# Altium schematic sheet EEG&ECG.SchDoc
size A0
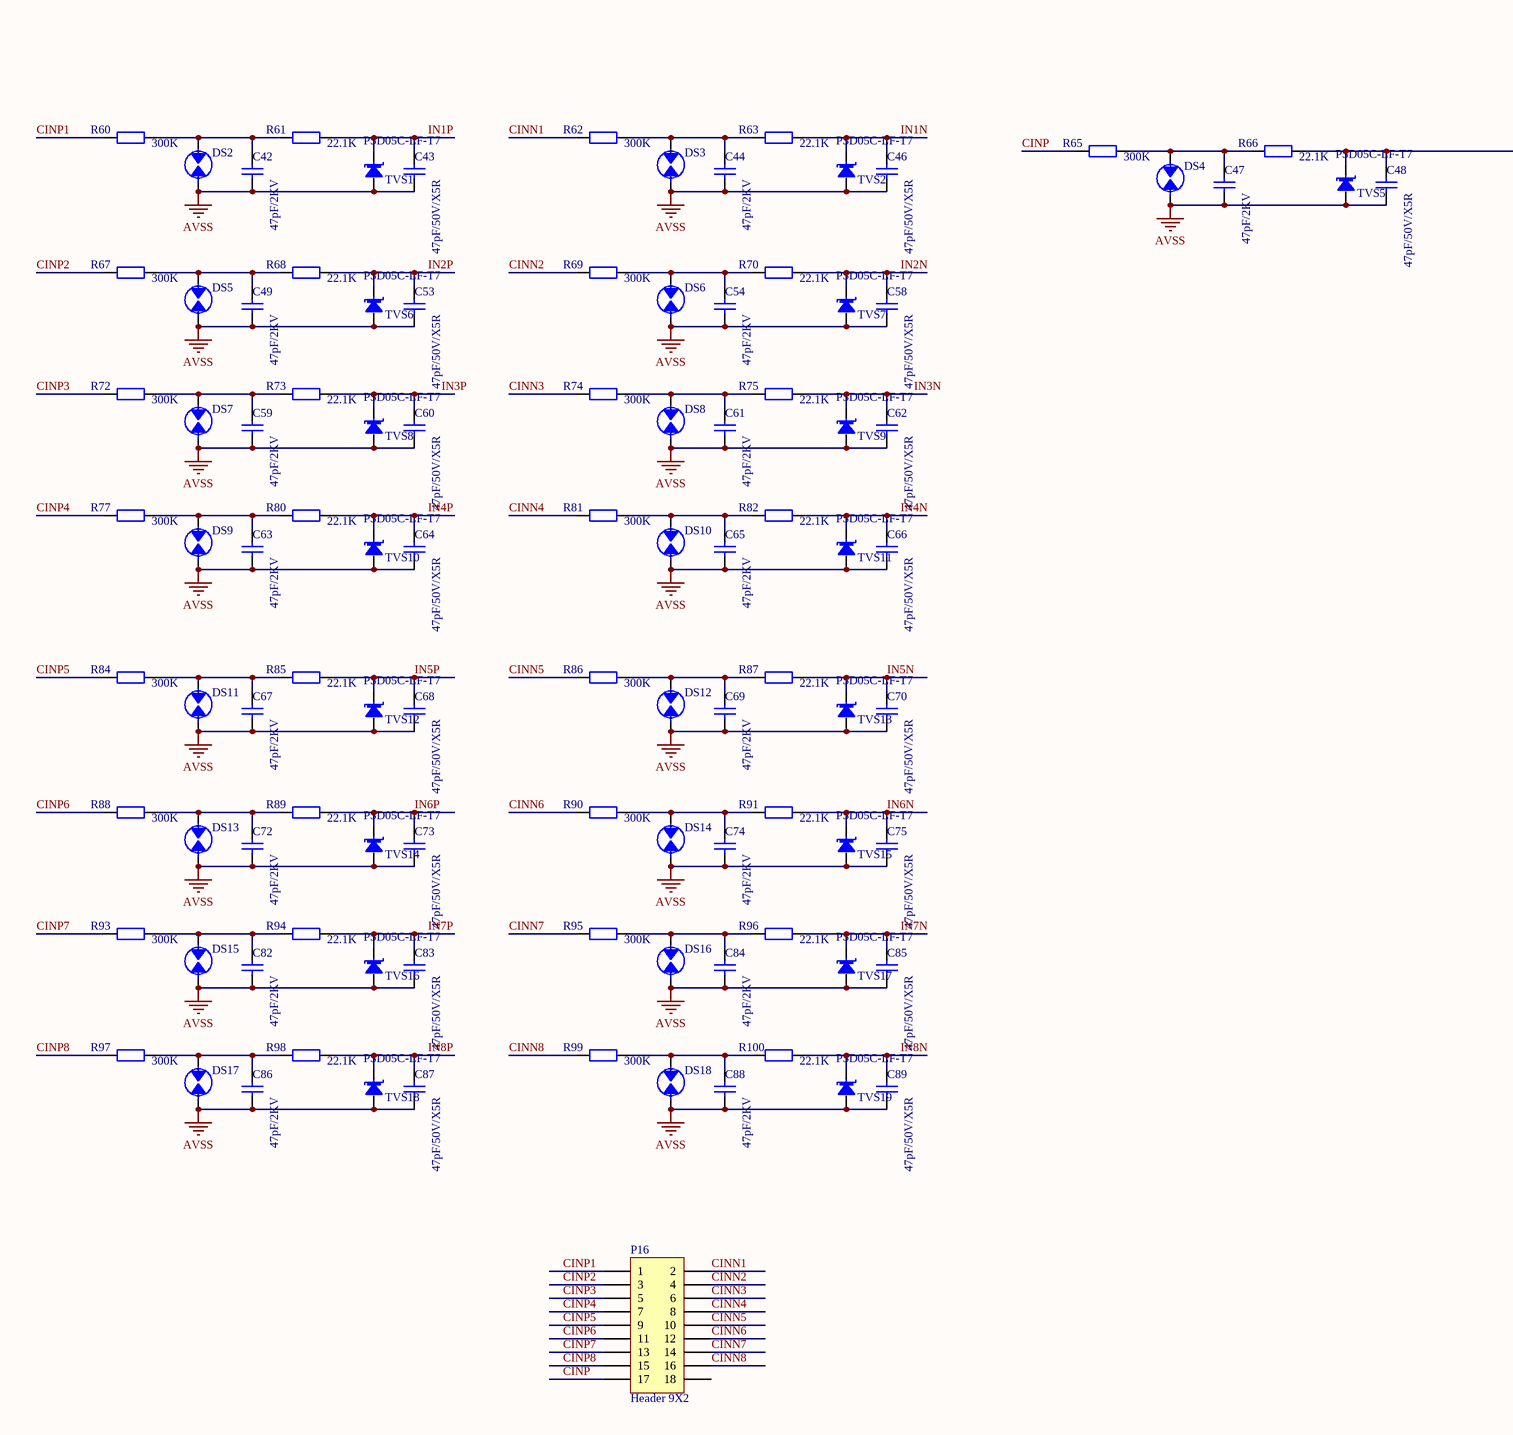
[diagram p0: EEG&ECG.SchDoc, top left]
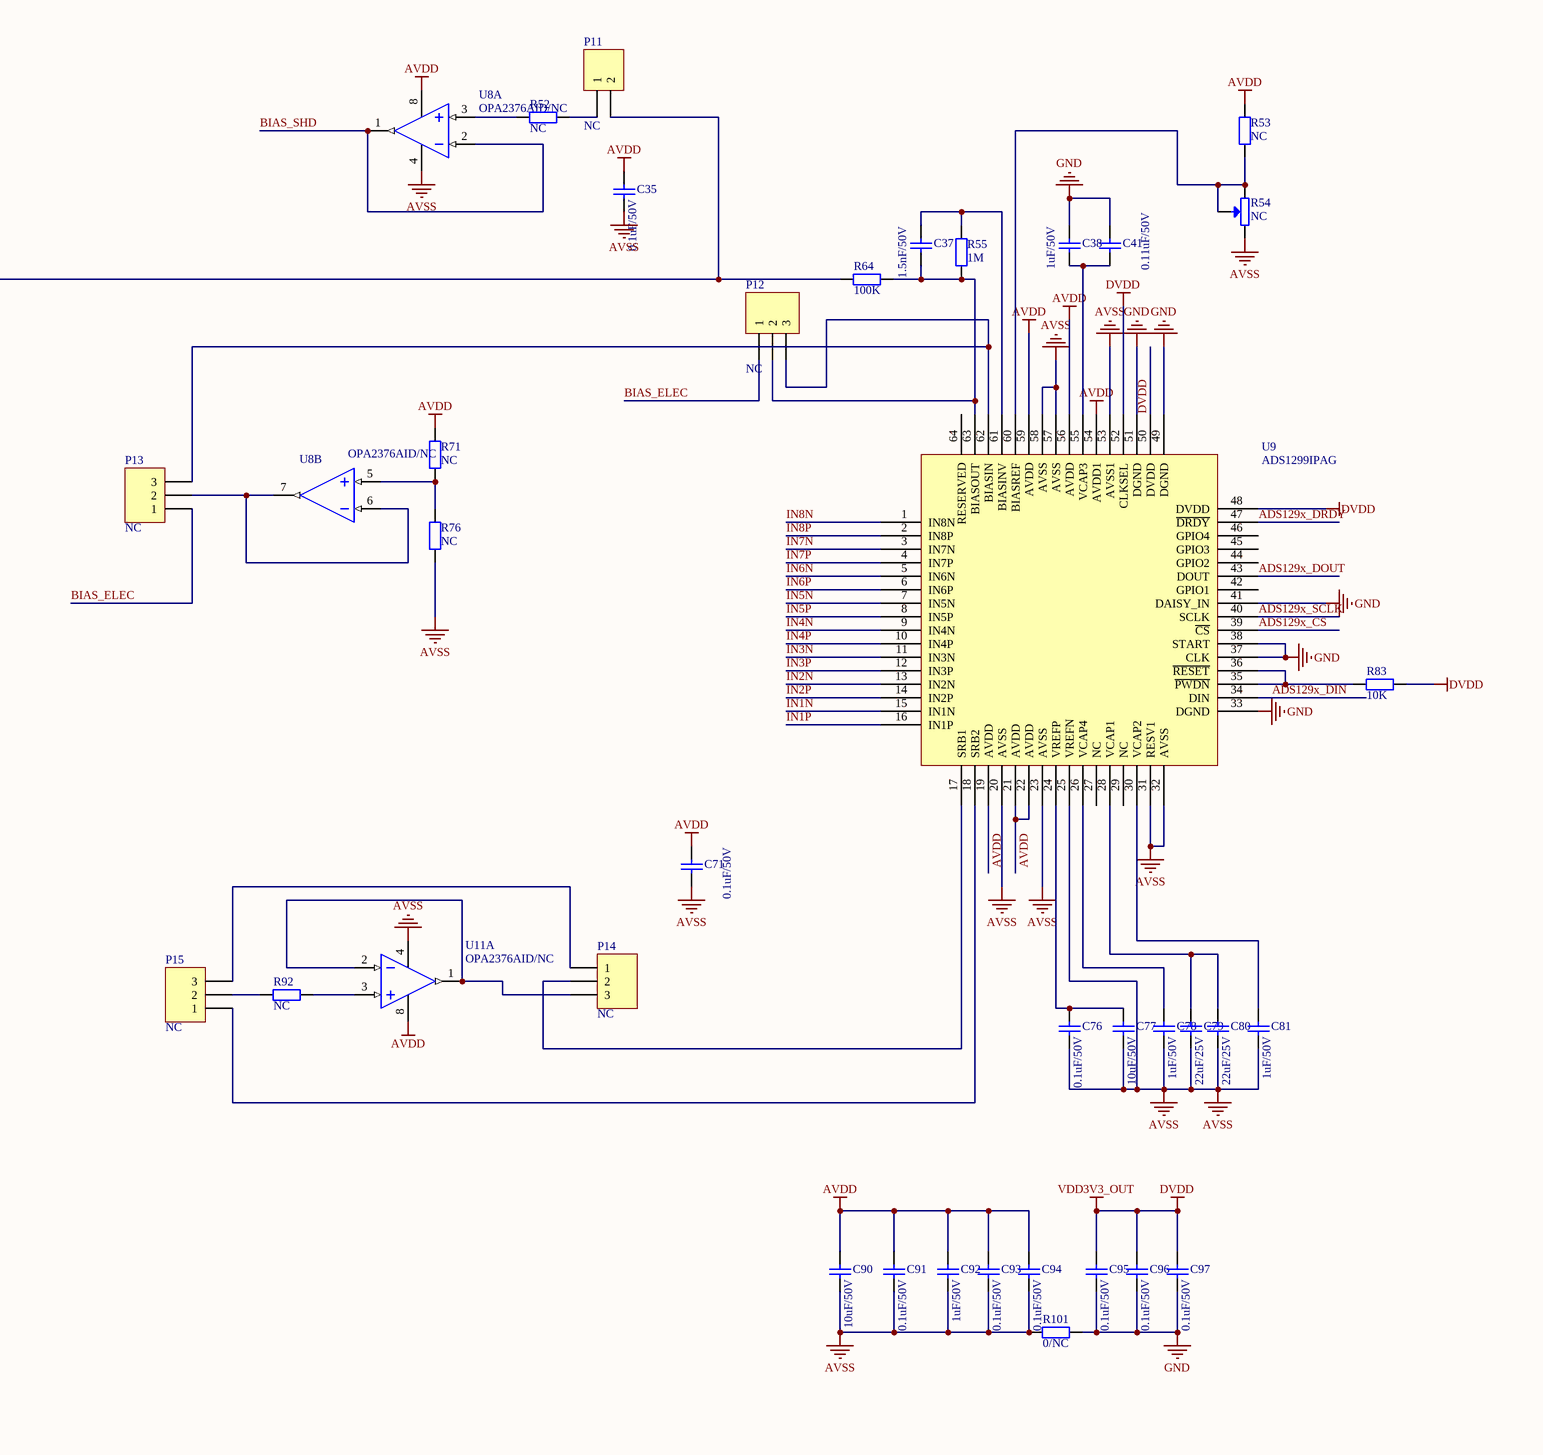
[diagram p1: EEG&ECG.SchDoc, top right]
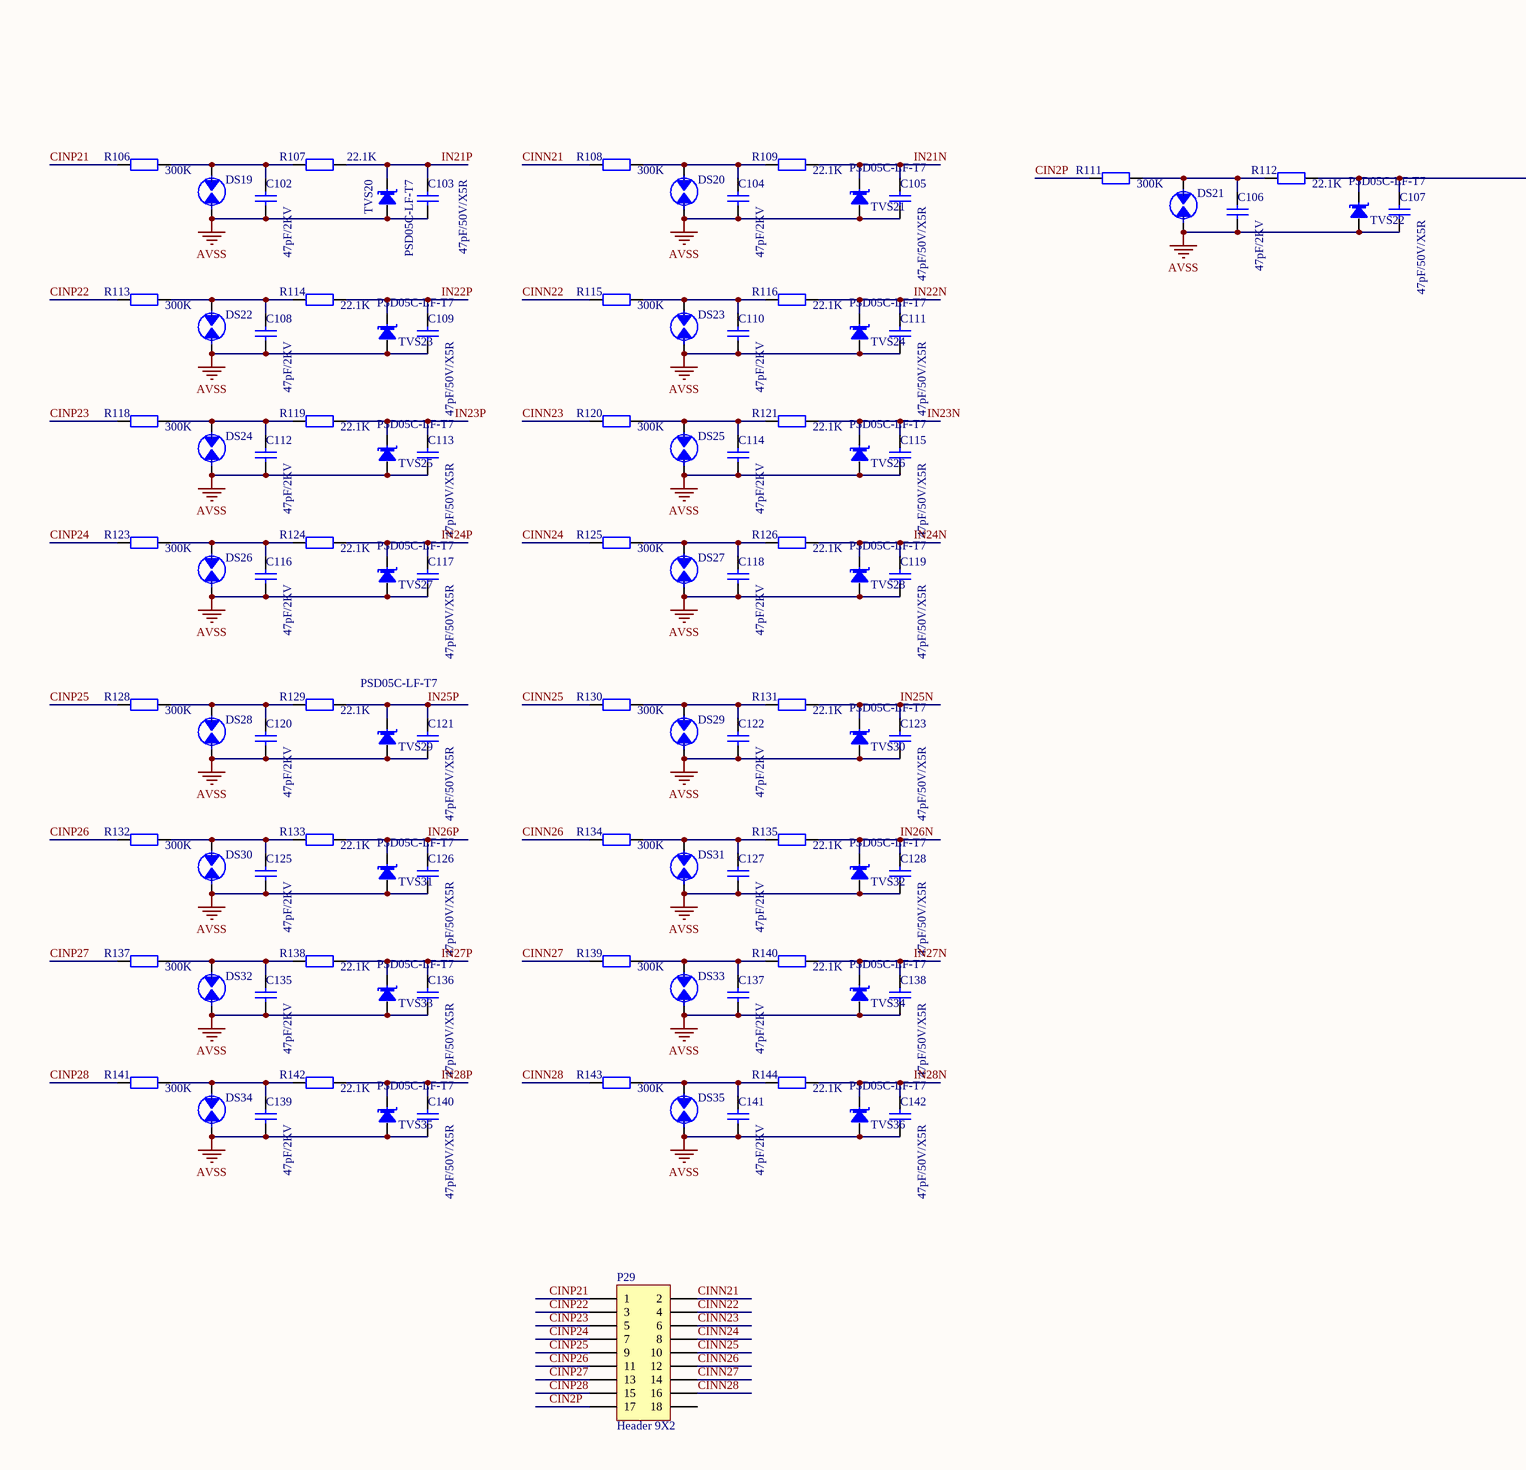
[diagram p2: EEG&ECG.SchDoc, bottom left]
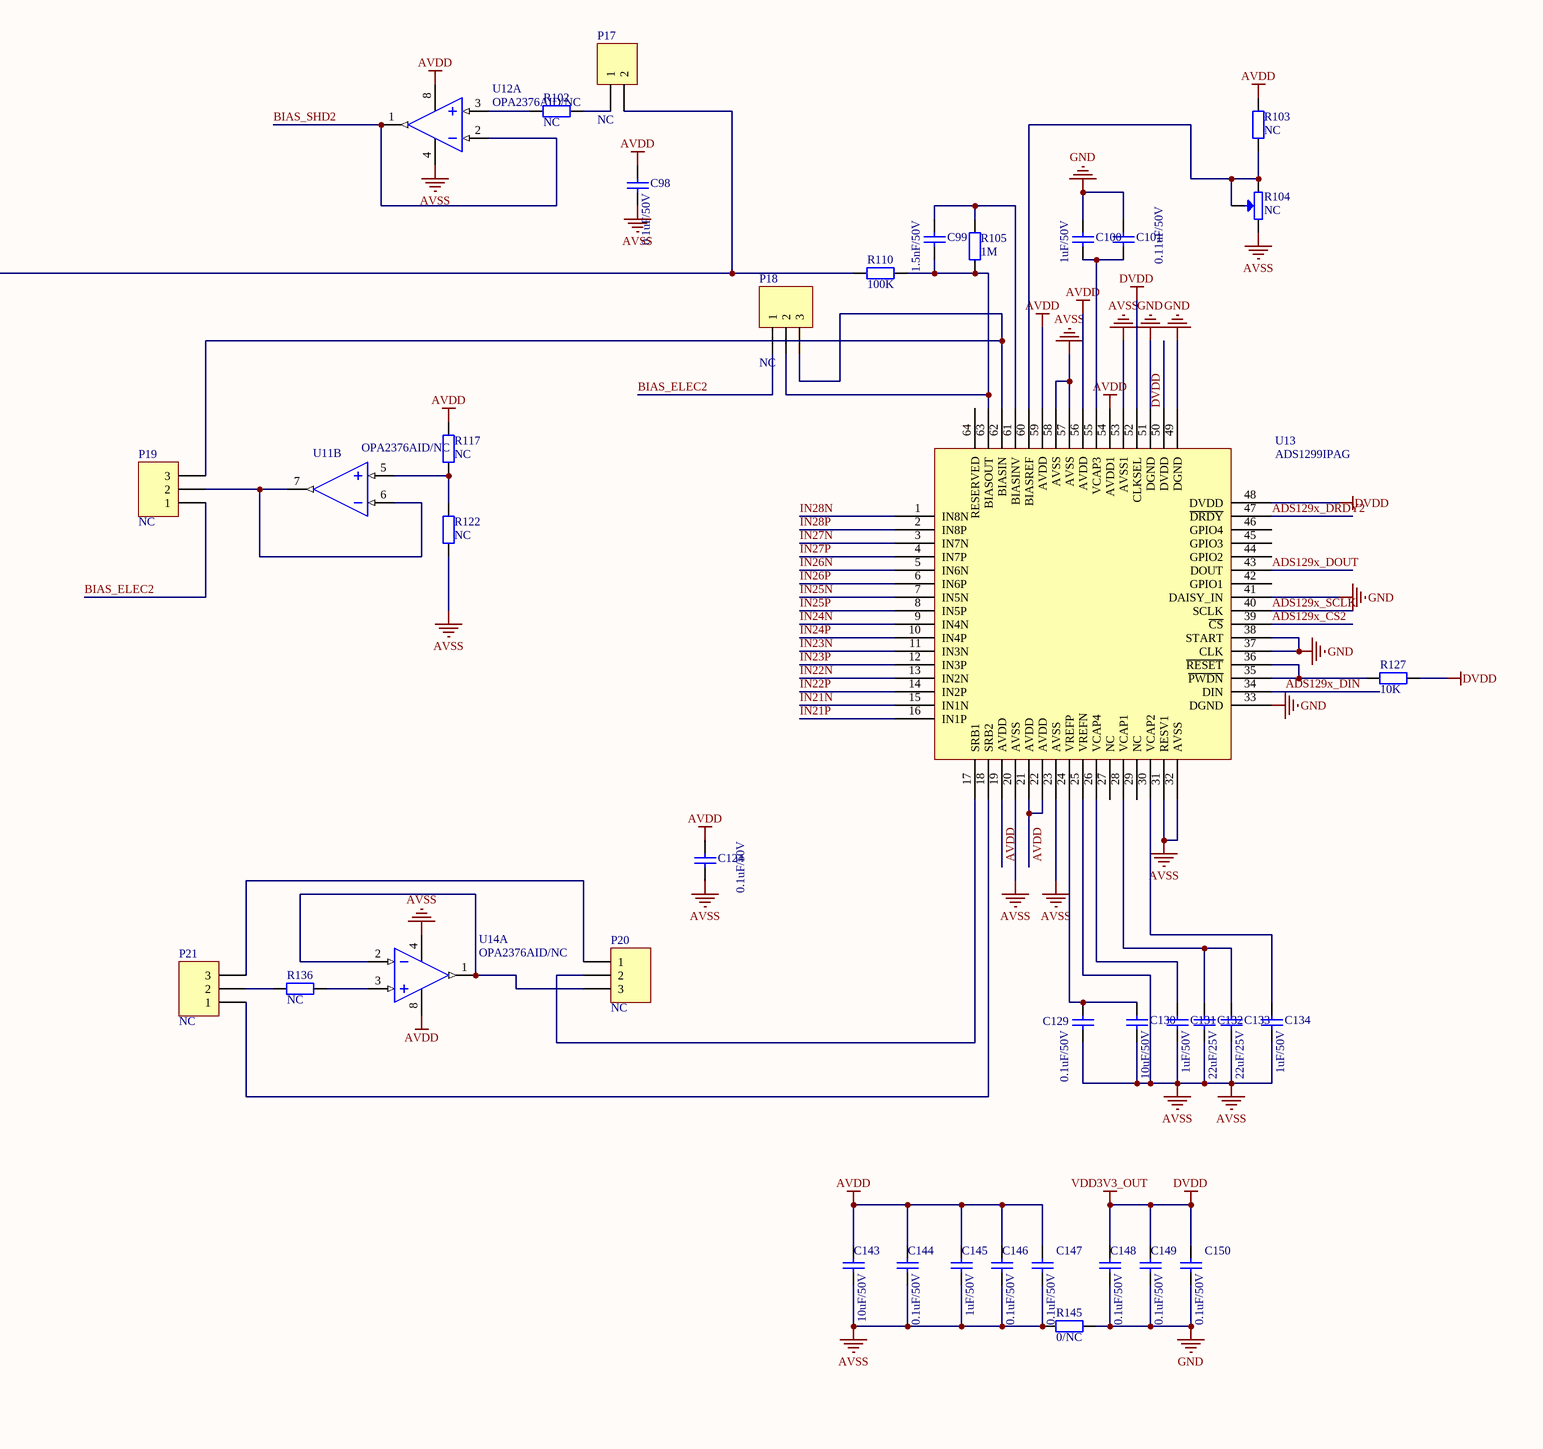
[diagram p3: EEG&ECG.SchDoc, bottom right]

## Parts
C35  0.1uF/50V  [SMD-0603C]
C37  1.5nF/50V  [SMD-0603C]
C38  1uF/50V  [SMD-0603C]
C41  0.11uF/50V  [SMD-0603C]
C42  47pF/2KV  [1206c]
C43  47pF/50V/X5R  [SMD-0603C]
C44  47pF/2KV  [1206c]
C46  47pF/50V/X5R  [SMD-0603C]
C47  47pF/2KV  [1206c]
C48  47pF/50V/X5R  [SMD-0603C]
C49  47pF/2KV  [1206c]
C53  47pF/50V/X5R  [SMD-0603C]
C54  47pF/2KV  [1206c]
C58  47pF/50V/X5R  [SMD-0603C]
C59  47pF/2KV  [1206c]
C60  47pF/50V/X5R  [SMD-0603C]
C61  47pF/2KV  [1206c]
C62  47pF/50V/X5R  [SMD-0603C]
C63  47pF/2KV  [1206c]
C64  47pF/50V/X5R  [SMD-0603C]
C65  47pF/2KV  [1206c]
C66  47pF/50V/X5R  [SMD-0603C]
C67  47pF/2KV  [1206c]
C68  47pF/50V/X5R  [SMD-0603C]
C69  47pF/2KV  [1206c]
C70  47pF/50V/X5R  [SMD-0603C]
C71  0.1uF/50V  [SMD-0603C]
C72  47pF/2KV  [1206c]
C73  47pF/50V/X5R  [SMD-0603C]
C74  47pF/2KV  [1206c]
C75  47pF/50V/X5R  [SMD-0603C]
C76  0.1uF/50V  [SMD-0603C]
C77  10uF/50V  [SMD-0805C]
C78  1uF/50V  [SMD-0603C]
C79  22uF/25V  [SMD-0805C]
C80  22uF/25V  [SMD-0805C]
C81  1uF/50V  [SMD-0603C]
C82  47pF/2KV  [1206c]
C83  47pF/50V/X5R  [SMD-0603C]
C84  47pF/2KV  [1206c]
C85  47pF/50V/X5R  [SMD-0603C]
C86  47pF/2KV  [1206c]
C87  47pF/50V/X5R  [SMD-0603C]
C88  47pF/2KV  [1206c]
C89  47pF/50V/X5R  [SMD-0603C]
C90  10uF/50V  [SMD-0805C]
C91  0.1uF/50V  [SMD-0603C]
C92  1uF/50V  [SMD-0603C]
C93  0.1uF/50V  [SMD-0603C]
C94  0.1uF/50V  [SMD-0603C]
C95  0.1uF/50V  [SMD-0603C]
C96  0.1uF/50V  [SMD-0603C]
C97  0.1uF/50V  [SMD-0603C]
C98  0.1uF/50V  [SMD-0603C]
C99  1.5nF/50V  [SMD-0603C]
C100  1uF/50V  [SMD-0603C]
C101  0.11uF/50V  [SMD-0603C]
C102  47pF/2KV  [1206c]
C103  47pF/50V/X5R  [SMD-0603C]
C104  47pF/2KV  [1206c]
C105  47pF/50V/X5R  [SMD-0603C]
C106  47pF/2KV  [1206c]
C107  47pF/50V/X5R  [SMD-0603C]
C108  47pF/2KV  [1206c]
C109  47pF/50V/X5R  [SMD-0603C]
C110  47pF/2KV  [1206c]
C111  47pF/50V/X5R  [SMD-0603C]
C112  47pF/2KV  [1206c]
C113  47pF/50V/X5R  [SMD-0603C]
C114  47pF/2KV  [1206c]
C115  47pF/50V/X5R  [SMD-0603C]
C116  47pF/2KV  [1206c]
C117  47pF/50V/X5R  [SMD-0603C]
C118  47pF/2KV  [1206c]
C119  47pF/50V/X5R  [SMD-0603C]
C120  47pF/2KV  [1206c]
C121  47pF/50V/X5R  [SMD-0603C]
C122  47pF/2KV  [1206c]
C123  47pF/50V/X5R  [SMD-0603C]
C124  0.1uF/50V  [SMD-0603C]
C125  47pF/2KV  [1206c]
C126  47pF/50V/X5R  [SMD-0603C]
C127  47pF/2KV  [1206c]
C128  47pF/50V/X5R  [SMD-0603C]
C129  0.1uF/50V  [SMD-0603C]
C130  10uF/50V  [SMD-0805C]
C131  1uF/50V  [SMD-0603C]
C132  22uF/25V  [SMD-0805C]
C133  22uF/25V  [SMD-0805C]
C134  1uF/50V  [SMD-0603C]
C135  47pF/2KV  [1206c]
C136  47pF/50V/X5R  [SMD-0603C]
C137  47pF/2KV  [1206c]
C138  47pF/50V/X5R  [SMD-0603C]
C139  47pF/2KV  [1206c]
C140  47pF/50V/X5R  [SMD-0603C]
C141  47pF/2KV  [1206c]
C142  47pF/50V/X5R  [SMD-0603C]
C143  10uF/50V  [SMD-0805C]
C144  0.1uF/50V  [SMD-0603C]
C145  1uF/50V  [SMD-0603C]
C146  0.1uF/50V  [SMD-0603C]
C147  0.1uF/50V  [SMD-0603C]
C148  0.1uF/50V  [SMD-0603C]
C149  0.1uF/50V  [SMD-0603C]
C150  0.1uF/50V  [SMD-0603C]
DS2  UN1812-90CSMD  [SMD-1812]  (value not drawn)
DS3  UN1812-90CSMD  [SMD-1812]  (value not drawn)
DS4  UN1812-90CSMD  [SMD-1812]  (value not drawn)
DS5  UN1812-90CSMD  [SMD-1812]  (value not drawn)
DS6  UN1812-90CSMD  [SMD-1812]  (value not drawn)
DS7  UN1812-90CSMD  [SMD-1812]  (value not drawn)
DS8  UN1812-90CSMD  [SMD-1812]  (value not drawn)
DS9  UN1812-90CSMD  [SMD-1812]  (value not drawn)
DS10  UN1812-90CSMD  [SMD-1812]  (value not drawn)
DS11  UN1812-90CSMD  [SMD-1812]  (value not drawn)
DS12  UN1812-90CSMD  [SMD-1812]  (value not drawn)
DS13  UN1812-90CSMD  [SMD-1812]  (value not drawn)
DS14  UN1812-90CSMD  [SMD-1812]  (value not drawn)
DS15  UN1812-90CSMD  [SMD-1812]  (value not drawn)
DS16  UN1812-90CSMD  [SMD-1812]  (value not drawn)
DS17  UN1812-90CSMD  [SMD-1812]  (value not drawn)
DS18  UN1812-90CSMD  [SMD-1812]  (value not drawn)
DS19  UN1812-90CSMD  [SMD-1812]  (value not drawn)
DS20  UN1812-90CSMD  [SMD-1812]  (value not drawn)
DS21  UN1812-90CSMD  [SMD-1812]  (value not drawn)
DS22  UN1812-90CSMD  [SMD-1812]  (value not drawn)
DS23  UN1812-90CSMD  [SMD-1812]  (value not drawn)
DS24  UN1812-90CSMD  [SMD-1812]  (value not drawn)
DS25  UN1812-90CSMD  [SMD-1812]  (value not drawn)
DS26  UN1812-90CSMD  [SMD-1812]  (value not drawn)
DS27  UN1812-90CSMD  [SMD-1812]  (value not drawn)
DS28  UN1812-90CSMD  [SMD-1812]  (value not drawn)
DS29  UN1812-90CSMD  [SMD-1812]  (value not drawn)
DS30  UN1812-90CSMD  [SMD-1812]  (value not drawn)
DS31  UN1812-90CSMD  [SMD-1812]  (value not drawn)
DS32  UN1812-90CSMD  [SMD-1812]  (value not drawn)
DS33  UN1812-90CSMD  [SMD-1812]  (value not drawn)
DS34  UN1812-90CSMD  [SMD-1812]  (value not drawn)
DS35  UN1812-90CSMD  [SMD-1812]  (value not drawn)
P11  NC  [HDR1X2]
P12  NC  [HDR1X3]
P13  NC  [HDR1X3]
P14  NC  [HDR1X3]
P15  NC  [HDR1X3]
P16  Header 9X2  [HDR2X9]
P17  NC  [HDR1X2]
P18  NC  [HDR1X3]
P19  NC  [HDR1X3]
P20  NC  [HDR1X3]
P21  NC  [HDR1X3]
P29  Header 9X2  [HDR2X9]
R52  NC  [SMD-0603]
R53  NC  [SMD-0603]
R54  NC  [VR-05]
R55  1M  [SMD-0603]
R60  300K  [SMD-0603]
R61  22.1K  [SMD-0603]
R62  300K  [SMD-0603]
R63  22.1K  [SMD-0603]
R64  100K  [SMD-0603]
R65  300K  [SMD-0603]
R66  22.1K  [SMD-0603]
R67  300K  [SMD-0603]
R68  22.1K  [SMD-0603]
R69  300K  [SMD-0603]
R70  22.1K  [SMD-0603]
R71  NC  [SMD-0603]
R72  300K  [SMD-0603]
R73  22.1K  [SMD-0603]
R74  300K  [SMD-0603]
R75  22.1K  [SMD-0603]
R76  NC  [SMD-0603]
R77  300K  [SMD-0603]
R80  22.1K  [SMD-0603]
R81  300K  [SMD-0603]
R82  22.1K  [SMD-0603]
R83  10K  [SMD-0603]
R84  300K  [SMD-0603]
R85  22.1K  [SMD-0603]
R86  300K  [SMD-0603]
R87  22.1K  [SMD-0603]
R88  300K  [SMD-0603]
R89  22.1K  [SMD-0603]
R90  300K  [SMD-0603]
R91  22.1K  [SMD-0603]
R92  NC  [SMD-0603]
R93  300K  [SMD-0603]
R94  22.1K  [SMD-0603]
R95  300K  [SMD-0603]
R96  22.1K  [SMD-0603]
R97  300K  [SMD-0603]
R98  22.1K  [SMD-0603]
R99  300K  [SMD-0603]
R100  22.1K  [SMD-0603]
R101  0/NC  [SMD-1206]
R102  NC  [SMD-0603]
R103  NC  [SMD-0603]
R104  NC  [VR-05]
R105  1M  [SMD-0603]
R106  300K  [SMD-0603]
R107  22.1K  [SMD-0603]
R108  300K  [SMD-0603]
R109  22.1K  [SMD-0603]
R110  100K  [SMD-0603]
R111  300K  [SMD-0603]
R112  22.1K  [SMD-0603]
R113  300K  [SMD-0603]
R114  22.1K  [SMD-0603]
R115  300K  [SMD-0603]
R116  22.1K  [SMD-0603]
R117  NC  [SMD-0603]
R118  300K  [SMD-0603]
R119  22.1K  [SMD-0603]
R120  300K  [SMD-0603]
R121  22.1K  [SMD-0603]
R122  NC  [SMD-0603]
R123  300K  [SMD-0603]
R124  22.1K  [SMD-0603]
R125  300K  [SMD-0603]
R126  22.1K  [SMD-0603]
R127  10K  [SMD-0603]
R128  300K  [SMD-0603]
R129  22.1K  [SMD-0603]
R130  300K  [SMD-0603]
R131  22.1K  [SMD-0603]
R132  300K  [SMD-0603]
R133  22.1K  [SMD-0603]
R134  300K  [SMD-0603]
R135  22.1K  [SMD-0603]
R136  NC  [SMD-0603]
R137  300K  [SMD-0603]
R138  22.1K  [SMD-0603]
R139  300K  [SMD-0603]
R140  22.1K  [SMD-0603]
R141  300K  [SMD-0603]
R142  22.1K  [SMD-0603]
R143  300K  [SMD-0603]
R144  22.1K  [SMD-0603]
R145  0/NC  [SMD-1206]
TVS1  PSD05C-LF-T7  [SOD-323]
TVS2  PSD05C-LF-T7  [SOD-323]
TVS5  PSD05C-LF-T7  [SOD-323]
TVS6  PSD05C-LF-T7  [SOD-323]
TVS7  PSD05C-LF-T7  [SOD-323]
TVS8  PSD05C-LF-T7  [SOD-323]
TVS9  PSD05C-LF-T7  [SOD-323]
TVS10  PSD05C-LF-T7  [SOD-323]
TVS11  PSD05C-LF-T7  [SOD-323]
TVS12  PSD05C-LF-T7  [SOD-323]
TVS13  PSD05C-LF-T7  [SOD-323]
TVS14  PSD05C-LF-T7  [SOD-323]
TVS15  PSD05C-LF-T7  [SOD-323]
TVS16  PSD05C-LF-T7  [SOD-323]
TVS17  PSD05C-LF-T7  [SOD-323]
TVS18  PSD05C-LF-T7  [SOD-323]
TVS19  PSD05C-LF-T7  [SOD-323]
TVS20  PSD05C-LF-T7  [SOD-323]
TVS21  PSD05C-LF-T7  [SOD-323]
TVS22  PSD05C-LF-T7  [SOD-323]
TVS23  PSD05C-LF-T7  [SOD-323]
TVS24  PSD05C-LF-T7  [SOD-323]
TVS25  PSD05C-LF-T7  [SOD-323]
TVS26  PSD05C-LF-T7  [SOD-323]
TVS27  PSD05C-LF-T7  [SOD-323]
TVS28  PSD05C-LF-T7  [SOD-323]
TVS29  PSD05C-LF-T7  [SOD-323]
TVS30  PSD05C-LF-T7  [SOD-323]
TVS31  PSD05C-LF-T7  [SOD-323]
TVS32  PSD05C-LF-T7  [SOD-323]
TVS33  PSD05C-LF-T7  [SOD-323]
TVS34  PSD05C-LF-T7  [SOD-323]
TVS35  PSD05C-LF-T7  [SOD-323]
TVS36  PSD05C-LF-T7  [SOD-323]
U8  OPA2376AID/NC  [SOIC-8]  (parts A,B of 2)
U9  ADS1299IPAG  [LQFP-64]
U11  OPA2376AID/NC  [SOIC-8]  (parts A,B of 2)
U12  OPA2376AID/NC  [SOIC-8]  (part A of 2)
U13  ADS1299IPAG  [LQFP-64]
U14  OPA2376AID/NC  [SOIC-8]  (part A of 2)

## Nets
AVDD: C35.2 C71.2 C90.2 C91.2 C92.2 C93.2 C94.2 C98.2 C124.2 C143.2 C144.2 C145.2 C146.2 C147.2 R53.1 R71.1 R103.1 R117.1 U8.8(V+) U9.19(AVDD) U9.21(AVDD) U9.22(AVDD) U9.54(AVDD1) U9.56(AVDD) U9.59(AVDD) U11.8(V+) U12.8(V+) U13.19(AVDD) U13.21(AVDD) U13.22(AVDD) U13.54(AVDD1) U13.56(AVDD) U13.59(AVDD) U14.8(V+)
AVSS: C35.1 C42.1 C43.1 C44.1 C46.1 C47.1 C48.1 C49.1 C53.1 C54.1 C58.1 C59.1 C60.1 C61.1 C62.1 C63.1 C64.1 C65.1 C66.1 C67.1 C68.1 C69.1 C70.1 C71.1 C72.1 C73.1 C74.1 C75.1 C76.1 C77.1 C78.1 C79.1 C80.1 C81.1 C82.1 C83.1 C84.1 C85.1 C86.1 C87.1 C88.1 C89.1 C90.1 C91.1 C92.1 C93.1 C94.1 C98.1 C102.1 C103.1 C104.1 C105.1 C106.1 C107.1 C108.1 C109.1 C110.1 C111.1 C112.1 C113.1 C114.1 C115.1 C116.1 C117.1 C118.1 C119.1 C120.1 C121.1 C122.1 C123.1 C124.1 C125.1 C126.1 C127.1 C128.1 C129.1 C130.1 C131.1 C132.1 C133.1 C134.1 C135.1 C136.1 C137.1 C138.1 C139.1 C140.1 C141.1 C142.1 C143.1 C144.1 C145.1 C146.1 C147.1 DS2.2 DS3.2 DS4.2 DS5.2 DS6.2 DS7.2 DS8.2 DS9.2 DS10.2 DS11.2 DS12.2 DS13.2 DS14.2 DS15.2 DS16.2 DS17.2 DS18.2 DS19.2 DS20.2 DS21.2 DS22.2 DS23.2 DS24.2 DS25.2 DS26.2 DS27.2 DS28.2 DS29.2 DS30.2 DS31.2 DS32.2 DS33.2 DS34.2 DS35.2 R54.1 R76.2 R101.2 R104.1 R122.2 R145.2 TVS1.1(A) TVS2.1(A) TVS5.1(A) TVS6.1(A) TVS7.1(A) TVS8.1(A) TVS9.1(A) TVS10.1(A) TVS11.1(A) TVS12.1(A) TVS13.1(A) TVS14.1(A) TVS15.1(A) TVS16.1(A) TVS17.1(A) TVS18.1(A) TVS19.1(A) TVS20.1(A) TVS21.1(A) TVS22.1(A) TVS23.1(A) TVS24.1(A) TVS25.1(A) TVS26.1(A) TVS27.1(A) TVS28.1(A) TVS29.1(A) TVS30.1(A) TVS31.1(A) TVS32.1(A) TVS33.1(A) TVS34.1(A) TVS35.1(A) TVS36.1(A) U8.4(V-) U9.20(AVSS) U9.23(AVSS) U9.25(VREFN) U9.31(RESV1) U9.32(AVSS) U9.53(AVSS1) U9.57(AVSS) U9.58(AVSS) U11.4(V-) U12.4(V-) U13.20(AVSS) U13.23(AVSS) U13.25(VREFN) U13.31(RESV1) U13.32(AVSS) U13.53(AVSS1) U13.57(AVSS) U13.58(AVSS) U14.4(V-)
DVDD: C95.2 C96.2 C97.2 C148.2 C149.2 C150.2 R83.1 R127.1 U9.48(DVDD) U9.50(DVDD) U9.52(CLKSEL) U13.48(DVDD) U13.50(DVDD) U13.52(CLKSEL)  [also labelled VDD3V3_OUT]
GND: C38.1 C41.1 C95.1 C96.1 C97.1 C100.1 C101.1 C148.1 C149.1 C150.1 R101.1 R145.1 U9.33(DGND) U9.37(CLK) U9.38(START) U9.41(DAISY_IN) U9.49(DGND) U9.51(DGND) U13.33(DGND) U13.37(CLK) U13.38(START) U13.41(DAISY_IN) U13.49(DGND) U13.51(DGND)
ADS129x_CS: U9.39(~{CS})
ADS129x_CS2: U13.39(~{CS})
ADS129x_DIN: U9.34(DIN) U13.34(DIN)
ADS129x_DOUT: U9.43(DOUT) U13.43(DOUT)
ADS129x_DRDY: U9.47(~{DRDY})
ADS129x_DRDY2: U13.47(~{DRDY})
ADS129x_SCLK: U9.40(SCLK) U13.40(SCLK)
BIAS_ELEC: P12.1 P13.1
BIAS_ELEC2: P18.1 P19.1
BIAS_SHD: U8.1(OUT1) U8.2(IN1-)
BIAS_SHD2: U12.1(OUT1) U12.2(IN1-)
CIN2P: P29.17 R111.1
CINN1: P16.2 R62.1
CINN2: P16.4 R69.1
CINN3: P16.6 R74.1
CINN4: P16.8 R81.1
CINN5: P16.10 R86.1
CINN6: P16.12 R90.1
CINN7: P16.14 R95.1
CINN8: P16.16 R99.1
CINN21: P29.2 R108.1
CINN22: P29.4 R115.1
CINN23: P29.6 R120.1
CINN24: P29.8 R125.1
CINN25: P29.10 R130.1
CINN26: P29.12 R134.1
CINN27: P29.14 R139.1
CINN28: P29.16 R143.1
CINP: P16.17 R65.1
CINP1: P16.1 R60.1
CINP2: P16.3 R67.1
CINP3: P16.5 R72.1
CINP4: P16.7 R77.1
CINP5: P16.9 R84.1
CINP6: P16.11 R88.1
CINP7: P16.13 R93.1
CINP8: P16.15 R97.1
CINP21: P29.1 R106.1
CINP22: P29.3 R113.1
CINP23: P29.5 R118.1
CINP24: P29.7 R123.1
CINP25: P29.9 R128.1
CINP26: P29.11 R132.1
CINP27: P29.13 R137.1
CINP28: P29.15 R141.1
IN1N: C46.2 R63.2 TVS2.2(B) U9.15(IN1N)
IN1P: C43.2 R61.2 TVS1.2(B) U9.16(IN1P)
IN2N: C58.2 R70.2 TVS7.2(B) U9.13(IN2N)
IN2P: C53.2 R68.2 TVS6.2(B) U9.14(IN2P)
IN3N: C62.2 R75.2 TVS9.2(B) U9.11(IN3N)
IN3P: C60.2 R73.2 TVS8.2(B) U9.12(IN3P)
IN4N: C66.2 R82.2 TVS11.2(B) U9.9(IN4N)
IN4P: C64.2 R80.2 TVS10.2(B) U9.10(IN4P)
IN5N: C70.2 R87.2 TVS13.2(B) U9.7(IN5N)
IN5P: C68.2 R85.2 TVS12.2(B) U9.8(IN5P)
IN6N: C75.2 R91.2 TVS15.2(B) U9.5(IN6N)
IN6P: C73.2 R89.2 TVS14.2(B) U9.6(IN6P)
IN7N: C85.2 R96.2 TVS17.2(B) U9.3(IN7N)
IN7P: C83.2 R94.2 TVS16.2(B) U9.4(IN7P)
IN8N: C89.2 R100.2 TVS19.2(B) U9.1(IN8N)
IN8P: C87.2 R98.2 TVS18.2(B) U9.2(IN8P)
IN21N: C105.2 R109.2 TVS21.2(B) U13.15(IN1N)
IN21P: C103.2 R107.2 TVS20.2(B) U13.16(IN1P)
IN22N: C111.2 R116.2 TVS24.2(B) U13.13(IN2N)
IN22P: C109.2 R114.2 TVS23.2(B) U13.14(IN2P)
IN23N: C115.2 R121.2 TVS26.2(B) U13.11(IN3N)
IN23P: C113.2 R119.2 TVS25.2(B) U13.12(IN3P)
IN24N: C119.2 R126.2 TVS28.2(B) U13.9(IN4N)
IN24P: C117.2 R124.2 TVS27.2(B) U13.10(IN4P)
IN25N: C123.2 R131.2 TVS30.2(B) U13.7(IN5N)
IN25P: C121.2 R129.2 TVS29.2(B) U13.8(IN5P)
IN26N: C128.2 R135.2 TVS32.2(B) U13.5(IN6N)
IN26P: C126.2 R133.2 TVS31.2(B) U13.6(IN6P)
IN27N: C138.2 R140.2 TVS34.2(B) U13.3(IN7N)
IN27P: C136.2 R138.2 TVS33.2(B) U13.4(IN7P)
IN28N: C142.2 R144.2 TVS36.2(B) U13.1(IN8N)
IN28P: C140.2 R142.2 TVS35.2(B) U13.2(IN8P)
NetC37_1: C37.1 R55.1 U9.61(BIASINV)
NetC37_2: C37.2 P12.2 R55.2 R64.1 U9.63(BIASOUT)
NetC38_2: C38.2 C41.2 U9.55(VCAP3)
NetC42_2: C42.2 DS2.1 R60.2 R61.1
NetC44_2: C44.2 DS3.1 R62.2 R63.1
NetC47_2: C47.2 DS4.1 R65.2 R66.1
NetC48_2: C48.2 P11.2 R64.2 R66.2 TVS5.2(B)
NetC49_2: C49.2 DS5.1 R67.2 R68.1
NetC54_2: C54.2 DS6.1 R69.2 R70.1
NetC59_2: C59.2 DS7.1 R72.2 R73.1
NetC61_2: C61.2 DS8.1 R74.2 R75.1
NetC63_2: C63.2 DS9.1 R77.2 R80.1
NetC65_2: C65.2 DS10.1 R81.2 R82.1
NetC67_2: C67.2 DS11.1 R84.2 R85.1
NetC69_2: C69.2 DS12.1 R86.2 R87.1
NetC72_2: C72.2 DS13.1 R88.2 R89.1
NetC74_2: C74.2 DS14.1 R90.2 R91.1
NetC76_2: C76.2 C77.2 U9.24(VREFP)
NetC78_2: C78.2 U9.26(VCAP4)
NetC79_2: C79.2 C80.2 U9.28(VCAP1)
NetC81_2: C81.2 U9.30(VCAP2)
NetC82_2: C82.2 DS15.1 R93.2 R94.1
NetC84_2: C84.2 DS16.1 R95.2 R96.1
NetC86_2: C86.2 DS17.1 R97.2 R98.1
NetC88_2: C88.2 DS18.1 R99.2 R100.1
NetC99_1: C99.1 R105.1 U13.61(BIASINV)
NetC99_2: C99.2 P18.2 R105.2 R110.1 U13.63(BIASOUT)
NetC100_2: C100.2 C101.2 U13.55(VCAP3)
NetC102_2: C102.2 DS19.1 R106.2 R107.1
NetC104_2: C104.2 DS20.1 R108.2 R109.1
NetC106_2: C106.2 DS21.1 R111.2 R112.1
NetC107_2: C107.2 P17.2 R110.2 R112.2 TVS22.2(B)
NetC108_2: C108.2 DS22.1 R113.2 R114.1
NetC110_2: C110.2 DS23.1 R115.2 R116.1
NetC112_2: C112.2 DS24.1 R118.2 R119.1
NetC114_2: C114.2 DS25.1 R120.2 R121.1
NetC116_2: C116.2 DS26.1 R123.2 R124.1
NetC118_2: C118.2 DS27.1 R125.2 R126.1
NetC120_2: C120.2 DS28.1 R128.2 R129.1
NetC122_2: C122.2 DS29.1 R130.2 R131.1
NetC125_2: C125.2 DS30.1 R132.2 R133.1
NetC127_2: C127.2 DS31.1 R134.2 R135.1
NetC129_2: C129.2 C130.2 U13.24(VREFP)
NetC131_2: C131.2 U13.26(VCAP4)
NetC132_2: C132.2 C133.2 U13.28(VCAP1)
NetC134_2: C134.2 U13.30(VCAP2)
NetC135_2: C135.2 DS32.1 R137.2 R138.1
NetC137_2: C137.2 DS33.1 R139.2 R140.1
NetC139_2: C139.2 DS34.1 R141.2 R142.1
NetC141_2: C141.2 DS35.1 R143.2 R144.1
NetP11_1: P11.1 R52.1
NetP12_3: P12.3 P13.3 U9.62(BIASIN)
NetP13_2: P13.2 U8.6(IN2-) U8.7(OUT2)
NetP14_1: P14.1 P15.3
NetP14_2: P14.2 U9.17(SRB1)
NetP14_3: P14.3 U11.1(OUT1) U11.2(IN1-)
NetP15_1: P15.1 U9.18(SRB2)
NetP15_2: P15.2 R92.1
NetP17_1: P17.1 R102.1
NetP18_3: P18.3 P19.3 U13.62(BIASIN)
NetP19_2: P19.2 U11.6(IN2-) U11.7(OUT2)
NetP20_1: P20.1 P21.3
NetP20_2: P20.2 U13.17(SRB1)
NetP20_3: P20.3 U14.1(OUT1) U14.2(IN1-)
NetP21_1: P21.1 U13.18(SRB2)
NetP21_2: P21.2 R136.1
NetR52_2: R52.2 U8.3(IN1+)
NetR53_2: R53.2 R54.2 R54.3 U9.60(BIASREF)
NetR71_2: R71.2 R76.1 U8.5(IN2+)
NetR83_2: R83.2 U9.35(~{PWDN}) U9.36(~{RESET})
NetR92_2: R92.2 U11.3(IN1+)
NetR102_2: R102.2 U12.3(IN1+)
NetR103_2: R103.2 R104.2 R104.3 U13.60(BIASREF)
NetR117_2: R117.2 R122.1 U11.5(IN2+)
NetR127_2: R127.2 U13.35(~{PWDN}) U13.36(~{RESET})
NetR136_2: R136.2 U14.3(IN1+)

Not connected (* = marked no-connect by the designer): P16 18; P29 18; U9 27(NC) 29(NC) 42(GPIO1) 44(GPIO2) 45(GPIO3) 46(GPIO4) 64(RESERVED); U13 27(NC) 29(NC) 42(GPIO1) 44(GPIO2) 45(GPIO3) 46(GPIO4) 64(RESERVED)

## Library data of the parts
C35 C37 C38 C41 C71 C76-C81 C90-C101 C124 C129-C134 C143-C150 = CAP4: 贴片电容 20%
C42-C44 C46-C49 C53 C54 C58-C70 C72-C75 C82-C89 C102-C123 C125-C128 C135-C142 = CAP4: 贴片电容 10%
DS2-DS35 = DISCHARE-1: 气体放电管 90V
P11 P17 = Header 2: Header, 2-Pin; LatestRevisionDate: 17-Jul-2002; LatestRevisionNote: Re-released for DXP Platform.; Publisher: Altium Limited
P12-P15 P18-P21 = Header 3: Header, 3-Pin; LatestRevisionDate: 17-Jul-2002; LatestRevisionNote: Re-released for DXP Platform.; Publisher: Altium Limited
P16 P29 = Header 9X2: Header, 9-Pin, Dual row; LatestRevisionDate: 17-Jul-2002; LatestRevisionNote: Re-released for DXP Platform.; Publisher: Altium Limited
R52 R53 R55 R64 R71 R76 R83 R92 R101-R103 R105 R110 R117 R122 R127 R136 R145 = RES2: 贴片电阻 5%
R54 R104 = RES4: 可调电阻
R60-R63 R65-R70 R72-R75 R77 R80-R82 R84-R91 R93-R100 R106-R109 R111-R116 R118-R121 R123-R126 R128-R135 R137-R144 = RES0: 贴片电阻 1%
TVS1 TVS2 TVS5-TVS36 = TVS-S: 单向TVS
U8 U11 U12 U14 = LM358: 运放